# EAGLE design RFM22-Sx-Breakout-v12 (EAGLE 5.07)
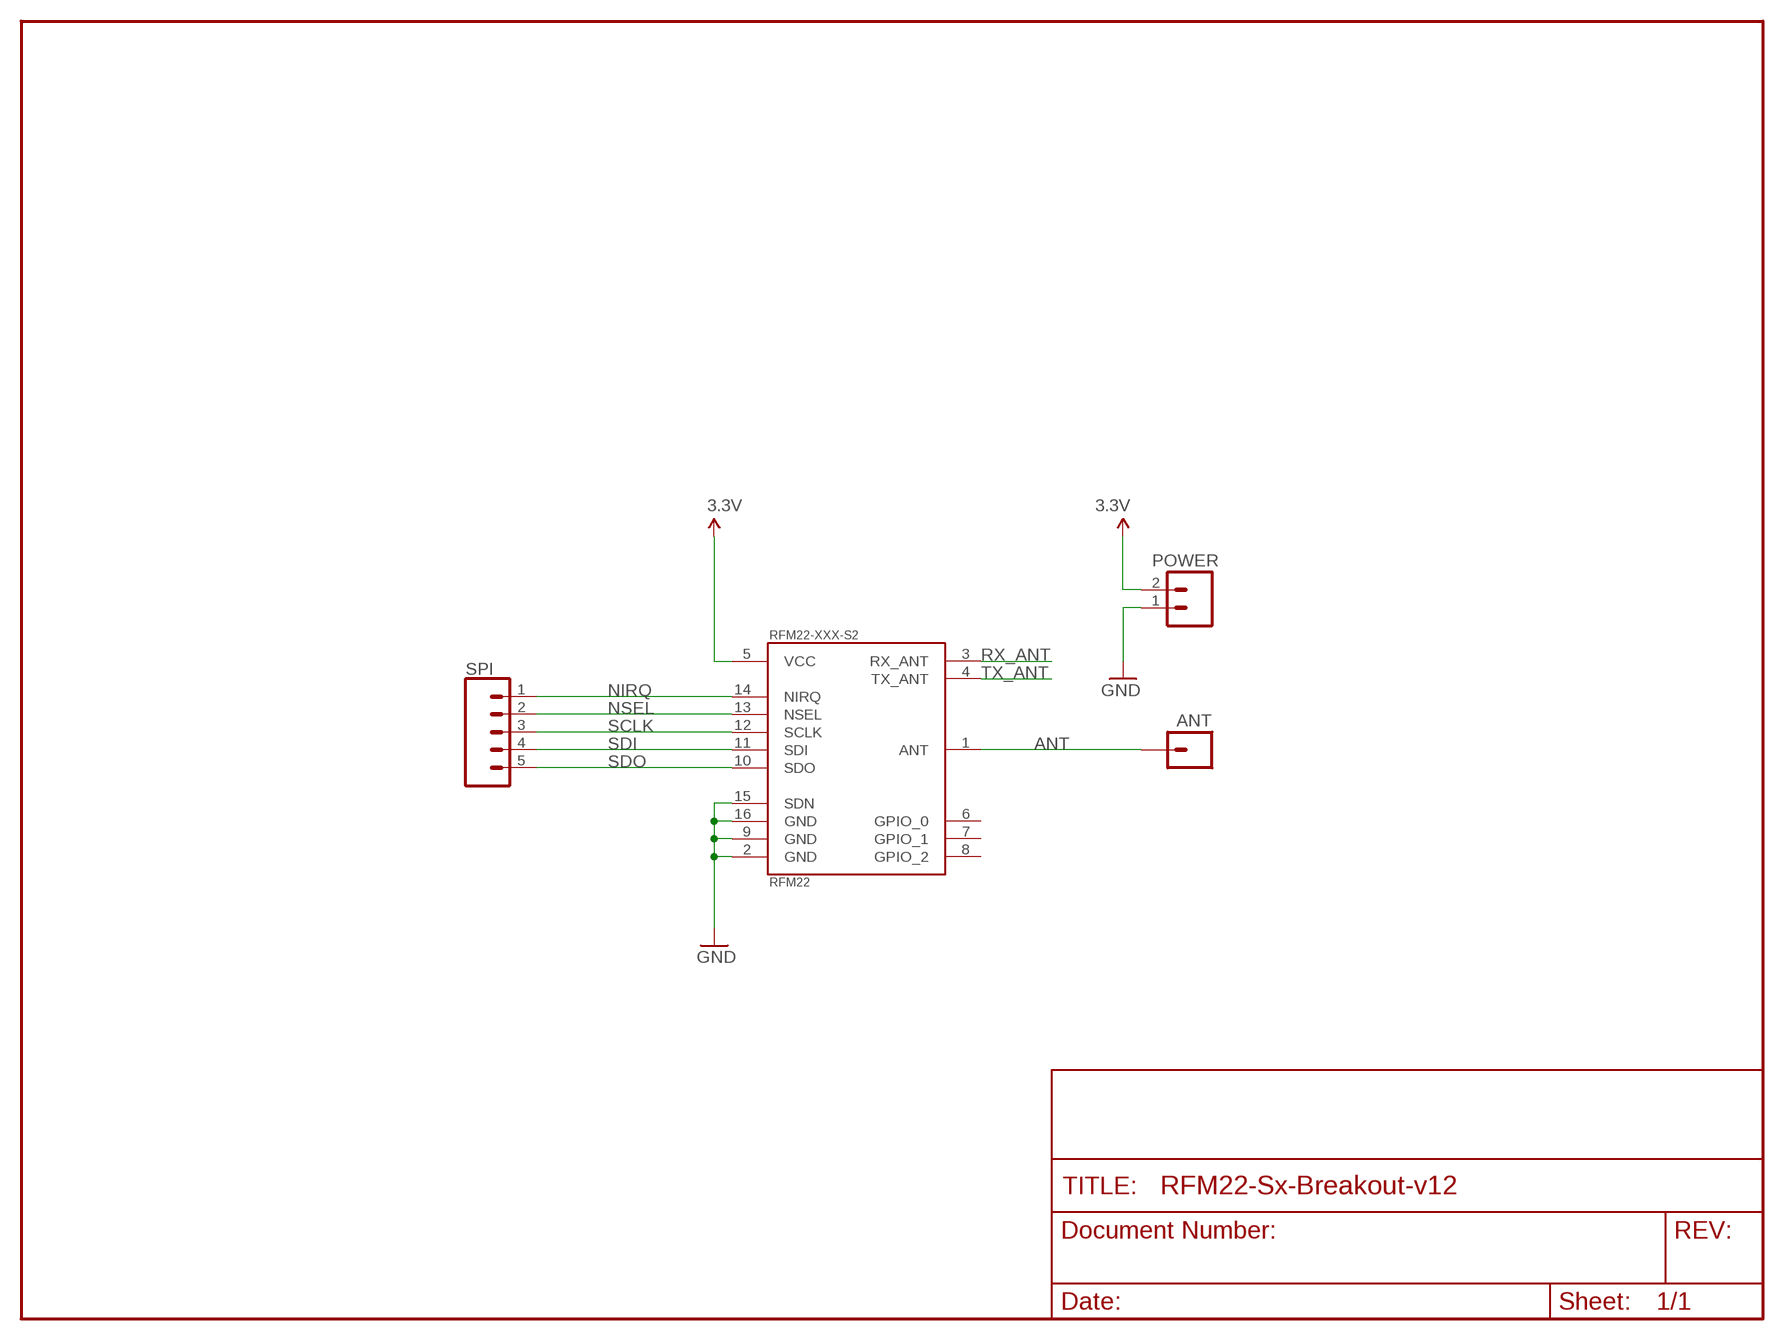
[diagram p0: schematic, sheet 1]

## Parts
JP0  POWER  M02PTH  [1X02]
JP2  ANT  M01PTH  [1X01]
JP4  SPI  M05PTH  [1X05]
RFM22-XXX-S2  RFM22  [RFM22-XXX-S2]

## Nets
3.3V: JP0.2 RFM22-XXX-S2.5(VCC)
ANT: JP2.1 RFM22-XXX-S2.1(ANT)
GND: JP0.1 RFM22-XXX-S2.2(GND) RFM22-XXX-S2.9(GND) RFM22-XXX-S2.15(SDN) RFM22-XXX-S2.16(GND)
NIRQ: JP4.1 RFM22-XXX-S2.14(NIRQ)
NSEL: JP4.2 RFM22-XXX-S2.13(NSEL)
RX_ANT: RFM22-XXX-S2.3(RX_ANT)
SCLK: JP4.3 RFM22-XXX-S2.12(SCLK)
SDI: JP4.4 RFM22-XXX-S2.11(SDI)
SDO: JP4.5 RFM22-XXX-S2.10(SDO)
TX_ANT: RFM22-XXX-S2.4(TX_ANT)
Unconnected: RFM22-XXX-S2.6(GPIO_0) RFM22-XXX-S2.7(GPIO_1) RFM22-XXX-S2.8(GPIO_2)

## Library data of the parts
JP0 = SparkFun:M02: Header 2 Standard 2-pin 0.1" header. Use with straight break away headers (SKU : PRT-00116), right angle break away headers (PRT-00553), swiss pins (PRT-00743), machine pins (PRT-00117), and female headers (PRT-00115). Molex polarized connector foot print use with SKU : PRT-08233 with associated crimp pins and housings.
JP2 = SparkFun:M01: Header 1 Standard 1-pin 0.1" header. Use with straight break away headers (SKU : PRT-00116), right angle break away headers (PRT-00553), swiss pins (PRT-00743), machine pins (PRT-00117), and female headers (PRT-00115).
JP4 = SparkFun:M05: Header 5 Standard 5-pin 0.1" header. Use with straight break away headers (SKU : PRT-00116), right angle break away headers (PRT-00553), swiss pins (PRT-00743), machine pins (PRT-00117), and female headers (PRT-00115). Molex polarized connector foot print use with SKU : PRT-08230 with associated crimp pins and housings.
RFM22-XXX-S2 = SparkFun:RFM22: *Hope RF's RFM22* Packages: RFM22-S2 (SMD)

## Board
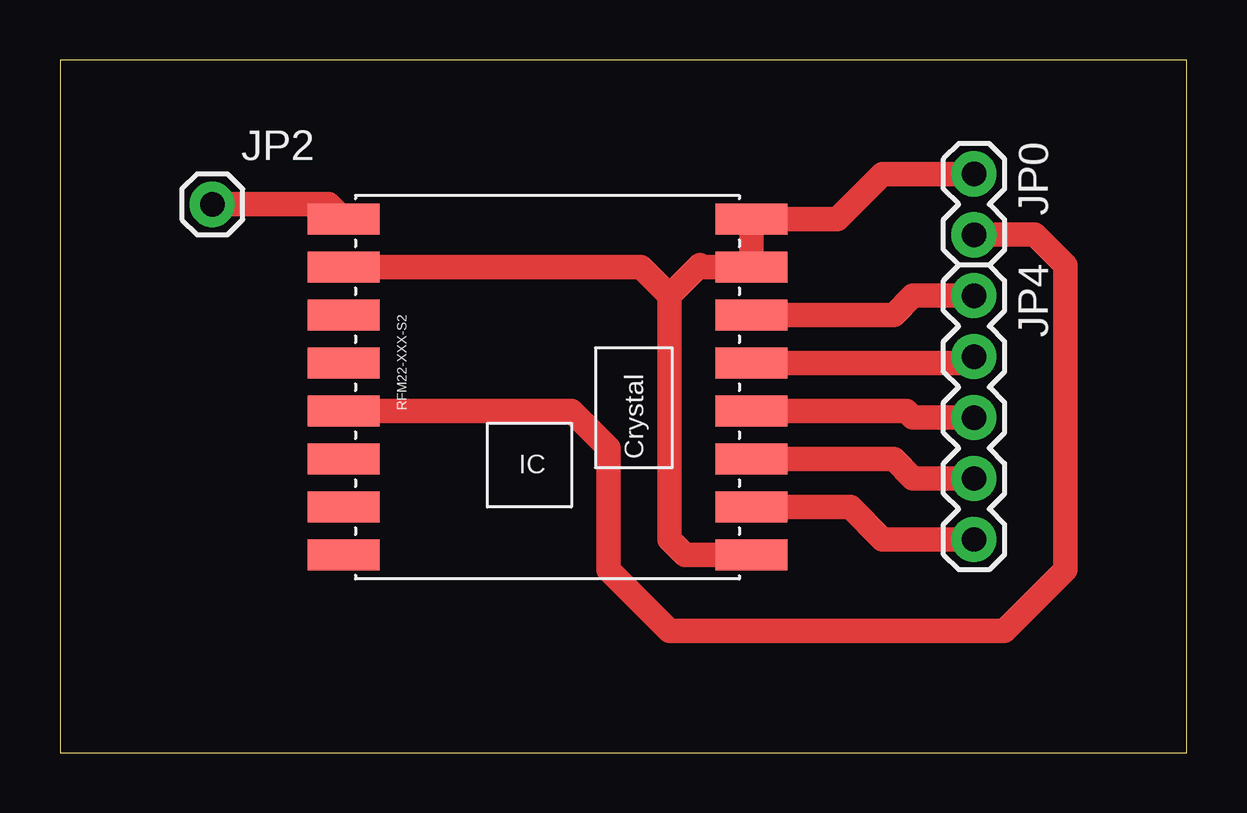
[diagram p1: board, top side]

Size 46.97 x 28.88 mm. Coordinates in mm from the lower left corner, seen from the top.
Outline: 0,0 46.97,0 46.97,28.88 0,28.88 0,0
Copper layers (1*16): Top 0.035mm / dielectric 1.5mm / Bottom 0.035mm
Design rules "default": minimum track width 10mil, minimum drill 24mil, track to track 8mil, track to pad 8mil, pad to pad 8mil, via to via 8mil, smd to smd 8mil, copper to edge 40mil, drill to drill 8mil, minimum pad ring 10mil, minimum via ring 8mil, stop-mask expansion 4mil, vias tented up to drill 0mil, thermal gap 10mil

### Footprints (pad centres in the part's own frame; a part is rotated, then mirrored left to right if it is on the bottom)
1X02 = drill 1.016 pad 1.88 round: 1 0,0; 2 2.54,0
1X01 = drill 1.016 pad 1.88 round: 1 0,0
1X05 = drill 1.016 pad 1.88 round: 1 0,0; 2 2.54,0; 3 5.08,0; 4 7.62,0; 5 10.16,0
RFM22-XXX-S2 = smd 3 x 1.3: 1 -8.5,7; 2 -8.5,5; 3 -8.5,3; 4 -8.5,1; 5 -8.5,-1; 6 -8.5,-3; 7 -8.5,-5; 8 -8.5,-7; 9 8.5,-7; 10 8.5,-5; 11 8.5,-3; 12 8.5,-1; 13 8.5,1; 14 8.5,3; 15 8.5,5; 16 8.5,7

### Placement (x,y rotation side)
JP0  38.1,24.13 270 top
JP2  6.35,22.86 0 top
JP4  38.1,19.05 270 top
RFM22-XXX-S2  20.32,15.24 0 top

### Tracks (layer width: path | path; a pad name or v marks a point on that pad's centre or on a via)
3.3V
  Top 1.016: RFM22-XXX-S2.5 21.32,14.24 22.86,12.7 22.86,7.62 25.4,5.08 39.37,5.08 41.91,7.62 41.91,20.32 40.64,21.59 JP0.2
ANT
  Top 1.016: JP2.1 11.2,22.86 RFM22-XXX-S2.1
GND
  Top 1.016: RFM22-XXX-S2.9 26.05,8.24 25.4,8.89 25.4,19.05 | 25.4,19.05 26.67,20.32 26.75,20.24 RFM22-XXX-S2.15 RFM22-XXX-S2.16 32.4,22.24 34.29,24.13 JP0.1 | RFM22-XXX-S2.2 24.21,20.24 25.4,19.05
NIRQ
  Top 1.016: RFM22-XXX-S2.14 34.75,18.24 35.56,19.05 JP4.1
NSEL
  Top 1.016: RFM22-XXX-S2.13 37.83,16.24 JP4.2
SCLK
  Top 1.016: RFM22-XXX-S2.12 35.29,14.24 35.56,13.97 JP4.3
SDI
  Top 1.016: RFM22-XXX-S2.11 34.75,12.24 35.56,11.43 JP4.4
SDO
  Top 1.016: RFM22-XXX-S2.10 32.94,10.24 34.29,8.89 JP4.5